# EAGLE design E (EAGLE 7.5.0)
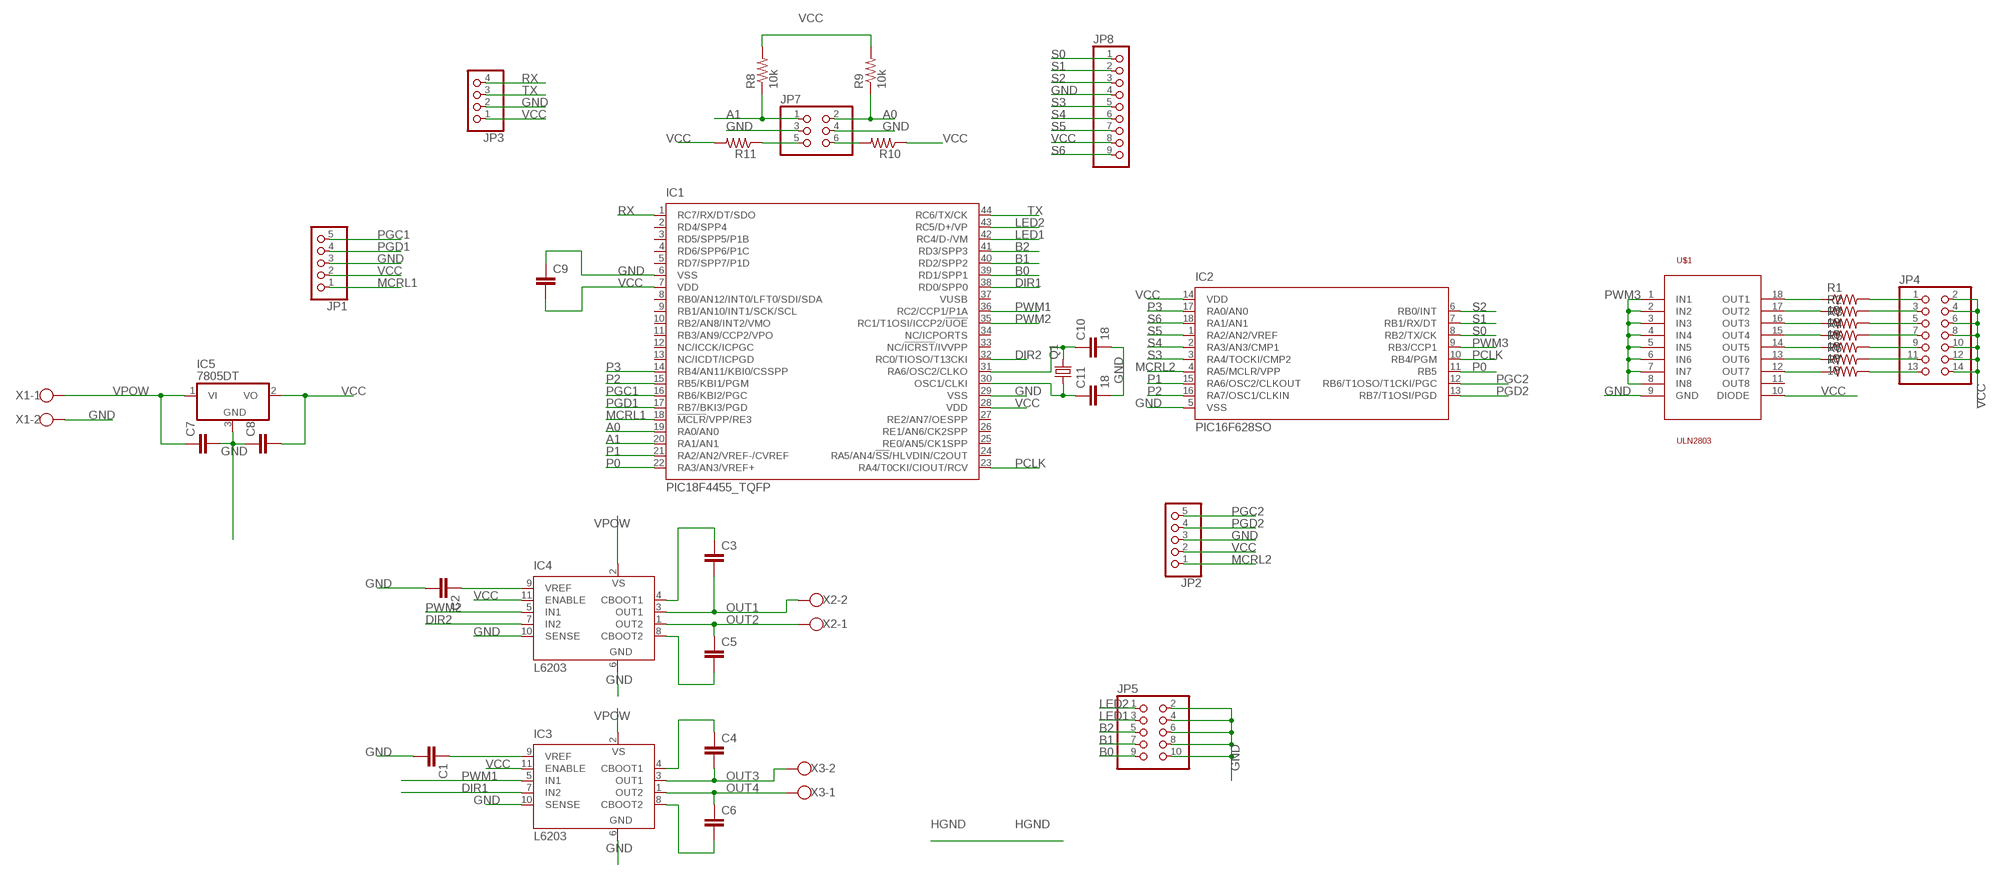
[diagram p0: schematic, sheet 1]

## Parts
C1  C2,5-3  [C2.5-3]
C2  C2,5-3  [C2.5-3]
C3  C2,5-3  [C2.5-3]
C4  C2,5-3  [C2.5-3]
C5  C2,5-3  [C2.5-3]
C6  C2,5-3  [C2.5-3]
C7  C2,5-3  [C2.5-3]
C8  C2,5-3  [C2.5-3]
C9  C2,5-3  [C2.5-3]
C10  18  C2,5-3  [C2.5-3]
C11  18  C2,5-3  [C2.5-3]
IC1  PIC18F4455_TQFP  [TQFP44]
IC2  PIC16F628SO  [SO-18W]
IC3  L6203  [MULTIWATT-11]
IC4  L6203  [MULTIWATT-11]
IC5  7805DT  [TO252]
JP1  PINHD-1X5  [1X05]
JP2  PINHD-1X5  [1X05]
JP3  PINHD-1X4  [1X04]
JP4  PINHD-2X7  [2X07]
JP5  PINHD-2X5  [2X05]
JP7  PINHD-2X3  [2X03]
JP8  PINHD-1X9  [1X09]
Q1  CRYSTALHC49S  [HC49/S]
R1  18  R-US_M1206  [M1206]
R2  18  R-US_M1206  [M1206]
R3  18  R-US_M1206  [M1206]
R4  18  R-US_M1206  [M1206]
R5  18  R-US_M1206  [M1206]
R6  18  R-US_M1206  [M1206]
R7  R-US_M1206  [M1206]
R8  10k  R-US_M1206  [M1206]
R9  10k  R-US_M1206  [M1206]
R10  R-US_M1206  [M1206]
R11  R-US_M1206  [M1206]
U$1  ULN2803  [SO18L]
X1  W237-102  [W237-102]
X2  W237-102  [W237-102]
X3  W237-102  [W237-102]

## Nets
A0: IC1.19(RA0/AN0) JP7.2 R9.1
A1: IC1.20(RA1/AN1) JP7.1 R8.1
B0: IC1.39(RD1/SPP1) JP5.9
B1: IC1.40(RD2/SPP2) JP5.7
B2: IC1.41(RD3/SPP3) JP5.5
DIR1: IC1.38(RD0/SPP0) IC3.7(IN2)
DIR2: IC1.32(RC0/TIOSO/T13CKI) IC4.7(IN2)
GND: C1.2 C2.2 C7.2 C8.1 C9.1 C10.2 C11.2 IC1.6(VSS) IC1.29(VSS) IC2.5(VSS) IC3.6(GND) IC3.10(SENSE) IC4.6(GND) IC4.10(SENSE) IC5.3(GND) JP1.3 JP2.3 JP3.2 JP5.2 JP5.4 JP5.6 JP5.8 JP5.10 JP7.3 JP7.4 JP8.4 U$1.9(GND) X1.2
LED1: IC1.42(RC4/D-/VM) JP5.3
LED2: IC1.43(RC5/D+/VP) JP5.1
MCRL1: IC1.18(!MCLR!/VPP/RE3) JP1.1
MCRL2: IC2.4(RA5/MCLR/VPP) JP2.1
N$1: C1.1 IC3.9(VREF)
N$2: C2.1 IC4.9(VREF)
N$3: C3.1 IC4.4(CBOOT1)
N$4: C4.1 IC3.4(CBOOT1)
N$5: C5.2 IC4.8(CBOOT2)
N$6: C6.2 IC3.8(CBOOT2)
N$7: R1.1 U$1.18(OUT1)
N$8: R2.1 U$1.17(OUT2)
N$9: R3.1 U$1.16(OUT3)
N$10: R4.1 U$1.15(OUT4)
N$11: R5.1 U$1.14(OUT5)
N$12: R6.1 U$1.13(OUT6)
N$13: R7.1 U$1.12(OUT7)
N$14: JP4.13 R7.2
N$15: JP4.11 R6.2
N$16: JP4.9 R5.2
N$17: JP4.7 R4.2
N$18: JP4.5 R3.2
N$19: JP4.3 R2.2
N$20: JP4.1 R1.2
N$21: JP7.5 R11.1
N$22: JP7.6 R10.2
N$23: C11.1 IC1.30(OSC1/CLKI) Q1.1
N$24: C10.1 IC1.31(RA6/OSC2/CLKO) Q1.2
OUT1 [VPOW]: C3.2 IC4.3(OUT1) X2.2
OUT2 [VPOW]: C5.1 IC4.1(OUT2) X2.1
OUT3 [VPOW]: C4.2 IC3.3(OUT1) X3.2
OUT4 [VPOW]: C6.1 IC3.1(OUT2) X3.1
P0: IC1.22(RA3/AN3/VREF+) IC2.11(RB5)
P1: IC1.21(RA2/AN2/VREF-/CVREF) IC2.15(RA6/OSC2/CLKOUT)
P2: IC1.15(RB5/KBI1/PGM) IC2.16(RA7/OSC1/CLKIN)
P3: IC1.14(RB4/AN11/KBI0/CSSPP) IC2.17(RA0/AN0)
PCLK: IC1.23(RA4/T0CKI/CIOUT/RCV) IC2.10(RB4/PGM)
PGC1: IC1.16(RB6/KBI2/PGC) JP1.5
PGC2: IC2.12(RB6/T1OSO/T1CKI/PGC) JP2.5
PGD1: IC1.17(RB7/BKI3/PGD) JP1.4
PGD2: IC2.13(RB7/T1OSI/PGD) JP2.4
PWM1: IC1.36(RC2/CCP1/P1A) IC3.5(IN1)
PWM2: IC1.35(RC1/T1OSI/ICCP2/!UOE) IC4.5(IN1)
PWM3: IC2.9(RB3/CCP1) U$1.1(IN1) U$1.2(IN2) U$1.3(IN3) U$1.4(IN4) U$1.5(IN5) U$1.6(IN6) U$1.7(IN7) U$1.8(IN8)
RX: IC1.1(RC7/RX/DT/SDO) JP3.4
S0: IC2.8(RB2/TX/CK) JP8.1
S1: IC2.7(RB1/RX/DT) JP8.2
S2: IC2.6(RB0/INT) JP8.3
S3: IC2.3(RA4/TOCKI/CMP2) JP8.5
S4: IC2.2(RA3/AN3/CMP1) JP8.6
S5: IC2.1(RA2/AN2/VREF) JP8.7
S6: IC2.18(RA1/AN1) JP8.9
TX: IC1.44(RC6/TX/CK) JP3.3
VCC: C8.2 C9.2 IC1.7(VDD) IC1.28(VDD) IC2.14(VDD) IC3.11(ENABLE) IC4.11(ENABLE) IC5.2(VO) JP1.2 JP2.2 JP3.1 JP4.2 JP4.4 JP4.6 JP4.8 JP4.10 JP4.12 JP4.14 JP8.8 R8.2 R9.2 R10.1 R11.2 U$1.10(DIODE)
VPOW [VPOW]: C7.1 IC3.2(VS) IC4.2(VS) IC5.1(VI) X1.1
Unconnected: IC1.2(RD4/SPP4) IC1.3(RD5/SPP5/P1B) IC1.4(RD6/SPP6/P1C) IC1.5(RD7/SPP7/P1D) IC1.8(RB0/AN12/INT0/LFT0/SDI/SDA) IC1.9(RB1/AN10/INT1/SCK/SCL) IC1.10(RB2/AN8/INT2/VMO) IC1.11(RB3/AN9/CCP2/VPO) IC1.12(NC/ICCK/ICPGC) IC1.13(NC/ICDT/ICPGD) IC1.24(RA5/AN4/!SS!/HLVDIN/C2OUT) IC1.25(RE0/AN5/CK1SPP) IC1.26(RE1/AN6/CK2SPP) IC1.27(RE2/AN7/OESPP) IC1.33(NC/!ICRST!/IVVPP) IC1.34(NC/ICPORTS) IC1.37(VUSB) U$1.11(OUT8)

## Library data of the parts
C1-C11 = capacitor-wima:C: CAPACITOR naming: grid - package width
IC1 = microchip:PIC18F4*_TQFP: USB Microcontrollers with nanoWatt Technology High-Performance, Enhanced Flash, 28/40/44-Pin, Source: http://ww1.microchip.com/downloads/en/devicedoc/39632c.pdf; MF: MICROCHIP; MPN: PIC18F4455-I/PT; OC_FARNELL: 9321322; OC_NEWARK: 08J9628
IC2 = microchip:PIC16F62*: FLASH-Based 8-Bit CMOS Microcontroller Source: http://ww1.microchip.com/downloads/en/DeviceDoc/40300C.pdf; MF: MICROCHIP; MPN: PIC16F628-20I/SO; OC_FARNELL: 9760415; OC_NEWARK: 23C4986
IC3 IC4 = st-microelectronics:L6203: DMOS FULL BRIDGE DRIVER; MPN: L6203; OC_FARNELL: 1467715; OC_NEWARK: 56P8434
IC5 = linear:78*: Positive VOLTAGE REGULATOR Source: http://cache.national.com/ds/LM/LM78L05.pdf http://www.fairchildsemi.com/ds/LM/LM7805.pdf
JP1 JP2 = pinhead:PINHD-1X5: PIN HEADER
JP3 = pinhead:PINHD-1X4: PIN HEADER
JP4 = pinhead:PINHD-2X7: PIN HEADER
JP5 = pinhead:PINHD-2X5: PIN HEADER
JP7 = pinhead:PINHD-2X3: PIN HEADER
JP8 = pinhead:PINHD-1X9: PIN HEADER
Q1 = crystal:CRYSTAL: CRYSTAL; OC_FARNELL: 1667008; OC_NEWARK: unknown
R1-R11 = resistor:R-US_: RESISTOR, American symbol
U$1 = uln2803:ULN2803
X1-X3 = con-wago-500:W237-102: WAGO SCREW CLAMP; MPN: 237-102; OC_FARNELL: unknown; OC_NEWARK: 70K9898

## Net classes
0 default: width 0.254 mm, clearance 0.254 mm
1 VPOW: width 1.016 mm, clearance 0.508 mm

## Board
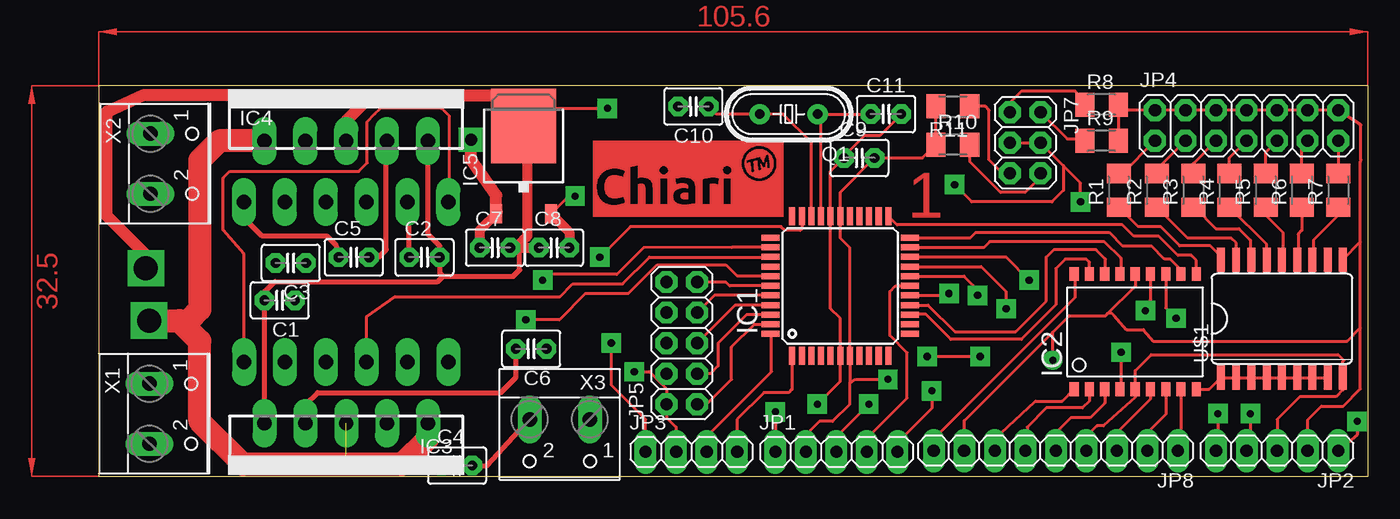
[diagram p1: board, top side]
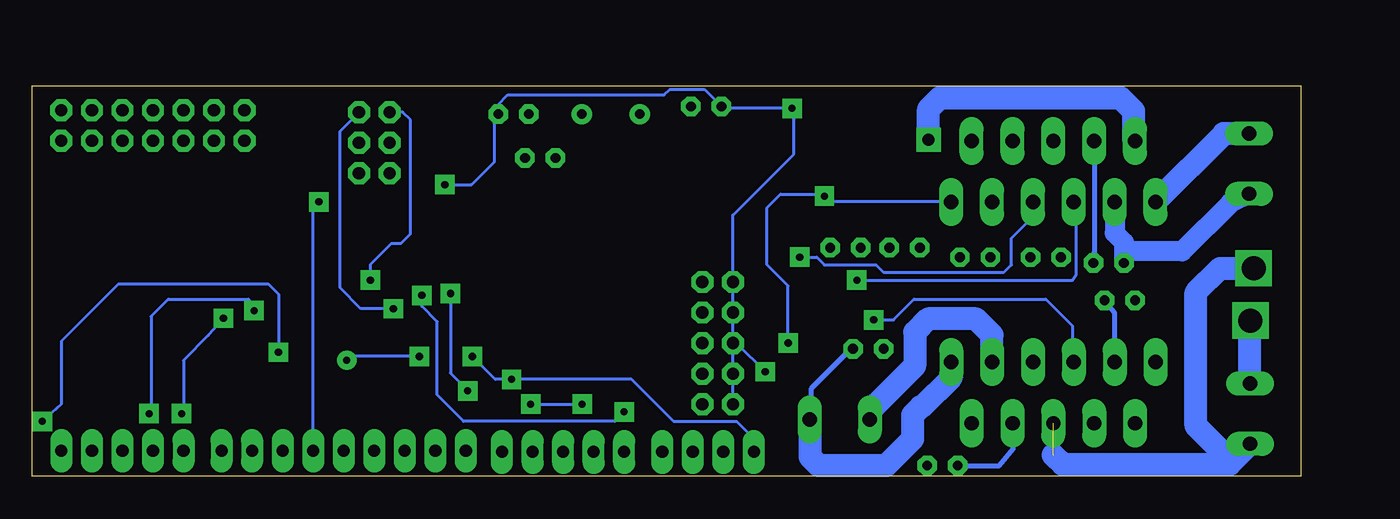
[diagram p2: board, bottom side, seen from below]

Size 105.6 x 32.5 mm. Coordinates in mm from the lower left corner, seen from the top.
Outline: 105.6,32.5 105.6,0 0,0 0,32.5 105.6,32.5
Copper layers (1*16): Top 0.035mm / dielectric 1.5mm / Bottom 0.035mm
Design rules "default *": minimum track width 10mil, minimum drill 24mil, track to track 8mil, track to pad 8mil, pad to pad 8mil, via to via 8mil, smd to smd 8mil, copper to edge 0mil, drill to drill 8mil, minimum pad ring 0.4mm, minimum via ring 20mil, stop-mask expansion 4mil, vias tented up to drill 0mil, thermal gap 10mil

### Footprints (pad centres in the part's own frame; a part is rotated, then mirrored left to right if it is on the bottom)
C2.5-3 = drill 0.813 pad 1.6 octagon: 1 -1.27,0; 2 1.27,0
TQFP44 = smd 1.5 x 0.5: 1 -5.8,4; 2 -5.8,3.2; 3 -5.8,2.4; 4 -5.8,1.6; 5 -5.8,0.8; 6 -5.8,0; 7 -5.8,-0.8; 8 -5.8,-1.6; 9 -5.8,-2.4; 10 -5.8,-3.2; 11 -5.8,-4; 23 5.8,-4; 24 5.8,-3.2; 25 5.8,-2.4; 26 5.8,-1.6; 27 5.8,-0.8; 28 5.8,0; 29 5.8,0.8; 30 5.8,1.6; 31 5.8,2.4; 32 5.8,3.2; 33 5.8,4 | smd 0.5 x 1.5: 12 -4,-5.8; 13 -3.2,-5.8; 14 -2.4,-5.8; 15 -1.6,-5.8; 16 -0.8,-5.8; 17 0,-5.8; 18 0.8,-5.8; 19 1.6,-5.8; 20 2.4,-5.8; 21 3.2,-5.8; 22 4,-5.8; 34 4,5.8; 35 3.2,5.8; 36 2.4,5.8; 37 1.6,5.8; 38 0.8,5.8; 39 0,5.8; 40 -0.8,5.8; 41 -1.6,5.8; 42 -2.4,5.8; 43 -3.2,5.8; 44 -4,5.8
SO-18W = smd 0.762 x 1.143: 1 -5.08,-4.788; 2 -3.81,-4.788; 3 -2.54,-4.788; 4 -1.27,-4.788; 5 0,-4.788; 6 1.27,-4.788; 7 2.54,-4.788; 8 3.81,-4.788; 9 5.08,-4.788; 10 5.08,4.788; 11 3.81,4.788; 12 2.54,4.788; 13 1.27,4.788; 14 0,4.788; 15 -1.27,4.788; 16 -2.54,4.788; 17 -3.81,4.788; 18 -5.08,4.788
MULTIWATT-11 = drill 1.2 long: 1 -8.5,-6.35; 2 -6.8,-1.27; 3 -5.1,-6.35; 4 -3.4,-1.27; 5 -1.7,-6.35; 6 0,-1.27; 7 1.7,-6.35; 8 3.4,-1.27; 9 5.1,-6.35; 10 6.8,-1.27; 11 8.5,-6.35
TO252 = smd 1 x 1.6: 1 -2.28,-4.8; 2 2.28,-4.8 | smd 5.4 x 6.2: 3 0,2.5
1X05 = drill 1.016 long: 1 -5.08,0; 2 -2.54,0; 3 0,0; 4 2.54,0; 5 5.08,0
1X04 = drill 1.016 long: 1 -3.81,0; 2 -1.27,0; 3 1.27,0; 4 3.81,0
2X07 = drill 1.016 octagon: 1 -7.62,-1.27; 2 -7.62,1.27; 3 -5.08,-1.27; 4 -5.08,1.27; 5 -2.54,-1.27; 6 -2.54,1.27; 7 0,-1.27; 8 0,1.27; 9 2.54,-1.27; 10 2.54,1.27; 11 5.08,-1.27; 12 5.08,1.27; 13 7.62,-1.27; 14 7.62,1.27
2X05 = drill 1.016 octagon: 1 -5.08,-1.27; 2 -5.08,1.27; 3 -2.54,-1.27; 4 -2.54,1.27; 5 0,-1.27; 6 0,1.27; 7 2.54,-1.27; 8 2.54,1.27; 9 5.08,-1.27; 10 5.08,1.27
2X03 = drill 1.016 octagon: 1 -2.54,-1.27; 2 -2.54,1.27; 3 0,-1.27; 4 0,1.27; 5 2.54,-1.27; 6 2.54,1.27
1X09 = drill 1.016 long: 1 -10.16,0; 2 -7.62,0; 3 -5.08,0; 4 -2.54,0; 5 0,0; 6 2.54,0; 7 5.08,0; 8 7.62,0; 9 10.16,0
HC49/S = drill 0.813 pad 1.676: 1 -2.413,0; 2 2.413,0
M1206 = smd 1.6 x 2: 1 -1.4,0; 2 1.4,0
SO18L = smd 0.66 x 2.032: 1 -5.08,-4.902; 2 -3.81,-4.902; 3 -2.54,-4.902; 4 -1.27,-4.902; 5 0,-4.902; 6 1.27,-4.902; 7 2.54,-4.902; 8 3.81,-4.902; 9 5.08,-4.902; 10 5.08,4.902; 11 3.81,4.902; 12 2.54,4.902; 13 1.27,4.902; 14 0,4.902; 15 -1.27,4.902; 16 -2.54,4.902; 17 -3.81,4.902; 18 -5.08,4.902
W237-102 = drill 1.194 long: 1 -2.5,-1.27; 2 2.5,-1.27

### Placement (x,y rotation side)
C1  15.05,14.65 180 top
C2  27.08,18.23 0 top
C3  15.97,17.76 180 top
C4  29.8,0.91 0 top
C5  21.21,18.23 0 top
C6  35.97,10.61 180 top
C7  32.96,19.03 0 top
C8  37.88,19.03 0 top
C9  63.28,26.49 0 top
C10  49.47,30.77 180 top
C11  65.5,30.14 0 top
IC1  61.69,15.85 90 top
IC2  86.23,12.04 0 top
IC3  20.57,3.15 180 top
IC4  20.57,29.19 0 top
IC5  35.34,26.65 0 top
JP1  61.37,2.04 0 top
JP2  98.04,2.14 180 top
JP3  49.31,2.04 0 top
JP4  95.5,29.19 0 top
JP5  48.51,11.09 90 top
JP7  77.09,27.76 270 top
JP8  79.63,2.14 180 top
Q1  57.4,30.14 180 top
R1  84.87,23.79 90 top
R2  88.04,23.79 90 top
R3  91.06,23.79 90 top
R4  94.08,23.79 90 top
R5  97.09,23.79 90 top
R6  100.11,23.79 90 top
R7  103.12,23.79 90 top
R8  83.44,30.93 0 top
R9  83.44,27.92 0 top
R10  71.06,27.6 0 top
R11  71.06,30.77 180 top
U$1  98.44,13.12 0 top
X1  5.48,5.22 270 top
X2  5.56,26.01 270 top
X3  38.35,3.47 180 top

### Tracks (layer width: path | path; a pad name or v marks a point on that pad's centre or on a via)
A0  (via drill 0.6)
  Top 0.254: JP7.2 80.58,28.08 81.88,28.08 R9.1 | IC1.19 73.42,17.45 75.5,15.38 v75.5,13.95
  Bottom 0.254: v75.5,13.95 78.2,13.95 79.95,15.69 79.95,28.71 JP7.2
A1  (via drill 0.6)
  Top 0.254: R8.1 82.04,31.22 81.22,32.05 76.77,32.05 75.82,31.09 JP7.1 | IC1.20 75.48,18.25 v77.41,16.33
  Bottom 0.254: v77.41,16.33 77.41,17.63 75.66,19.38 74.87,19.38 74.07,20.17 74.07,29.66 74.71,30.3 JP7.1
B0
  Top 0.254: IC1.39 52.48,15.85 52.17,16.17 JP5.9
B1
  Top 0.254: IC1.40 51.21,15.05 JP5.7
B2
  Top 0.254: JP5.5 52.96,14.26 55.88,14.26 IC1.41
DIR1  (via drill 0.6)
  Top 0.254: IC1.38 53.12,16.65 52.18,17.6 46.45,17.6 44.07,15.22 40.51,15.22 38.32,13.03 v35.53,13.03
  Bottom 0.254: v35.53,13.03 33.88,13.03 32.16,14.74 21.21,14.74 18.99,12.52 18.99,9.62 IC3.7
DIR2  (via drill 0.6)
  Top 0.254: IC1.32 58.49,20.59 58.36,20.46 57.09,20.46 56.77,20.77 44.23,20.77 v41.69,18.23
  Bottom 0.254: v41.69,18.23 40.26,18.23 39.62,17.6 35.34,17.6 34.7,16.96 24.7,16.96 24.07,17.6 24.07,19.82 22.32,21.57 22.32,22.79 IC4.7
GND  (via drill 0.6, 2)  (1 unrouted)
  Top 0.254: 35.66,28.71 37.56,30.62 v42.32,30.62 | JP1.3 61.37,3.31 v64.07,6.01 | v59.79,6.01 61.69,7.91 IC1.6 61.69,13.15 60.9,13.95 IC1.29 60.89,25.37 C9.1 62.01,26.65 63.75,28.39 65.02,28.39 C11.2 | JP2.3 98.04,4.74 99.95,6.64 102.97,6.64 103.52,7.2 U$1.9 103.52,9.58 103.6,9.66 103.12,10.14 87.57,10.14 86.23,8.8 IC2.5 86.23,6.58 83.6,4.2 83.06,4.2 82.17,3.31 JP8.4 | JP7.3 JP7.4 80.26,25.85 | 80.26,25.85 80.26,23.79 79.31,22.84 72.64,22.84 v71.22,24.27 | v81.69,22.84 81.69,24.42 80.26,25.85 | v44.55,8.71 45.82,8.71 47.24,7.28 47.24,4.9 48.04,4.11 JP3.2
  Top 0.406: IC4.10 27.4,27.89 27.4,20.14 28.35,19.19 C2.2 28.35,16.93 28.64,16.65 | 28.64,16.65 34.48,16.65 35.02,17.19 35.02,19.34 35.31,19.63 | IC3.10 C1.2 13.78,15.34 14.64,16.2 28.19,16.2 28.64,16.65
  Top 0.813: C8.1 C7.2 34.7,19.03 35.31,19.63 35.66,19.98 35.66,28.71 35.66,29.15 IC5.3
  Top 1.016: v3.91,17.31 3.91,18.42 0.66,21.67 0.66,30.34 3.75,31.73 21.7,31.73 | 21.7,31.73 22.16,31.73 | IC4.6 20.57,29.57 22.7,31.7 | 22.7,31.7 32.79,31.7 IC5.3 | 22.7,31.7 21.73,31.7 21.7,31.73
  Bottom 0.254: v64.07,6.01 v59.79,6.01 | v71.22,24.27 68.99,24.27 67.09,26.17 67.09,29.82 C11.2 66.77,30.93 65.98,31.73 52.96,31.73 52.48,32.2 49.62,32.2 C10.2 48.04,30.62 v42.32,30.62 42.16,30.46 42.16,26.81 47.24,21.73 JP5.10 JP5.8 JP5.6 | JP5.2 JP5.4 JP5.6 | JP5.6 46.93,11.09 v44.55,8.71 | JP8.4 82.17,22.36 v81.69,22.84
  Bottom 1.93: 20.57,1.77 19.8,1 5.93,1 | 5.93,1 X1.2 | 5.93,1 5.93,1.43 8.7,4.2 8.7,15.3 6.7,17.3 3.92,17.3 v3.91,17.31
LED1
  Top 0.254: IC1.42 53.89,13.45 51.53,11.09 51.53,9.19 50.9,8.55 JP5.3
LED2
  Top 0.254: JP5.1 50.58,6.01 52.64,8.07 52.64,10.77 54.55,12.68 55.87,12.68 IC1.43
MCRL1  (via drill 0.6)
  Top 0.254: IC1.18 72,16.65 73.12,15.53 v73.12,15.06 | v56.29,5.38 JP1.1
  Bottom 0.254: v56.29,5.38 57.09,4.58 69.66,4.58 71.85,6.77 71.85,12.87 73.12,14.14 v73.12,15.06
MCRL2  (via drill 0.6)
  Top 0.254: 84.87,7.35 IC2.4 85.06,7.35 v85.06,10.33 | v104.71,4.58 104.71,3.47 JP2.1
  Bottom 0.254: v104.71,4.58 103.12,6.01 103.12,11.25 98.36,16.01 85.92,16.01 85.06,15.15 v85.06,10.33
N$1
  Bottom 0.406: IC3.9 15.47,13.61 C1.1
N$2
  Top 0.406: C2.1 25.81,22.7 IC4.9
N$3
  Bottom 0.406: IC4.4 17.17,18.62 C3.1
N$4
  Bottom 0.406: C4.1 25.08,0.91 23.91,2.28 23.91,4.36 IC3.4
N$5
  Top 0.406: C5.2 23.27,18.23 23.91,18.87 23.91,27.85 IC4.8
N$6
  Top 0.406: IC3.8 17.17,5.94 18.19,6.96 33.43,6.96 34.7,8.23 C6.2
N$7
  Top 0.254: U$1.18 93.36,18.31 92.49,19.19 89.95,19.19 88.36,20.77 86.48,20.77 R1.1
N$8
  Top 0.254: U$1.17 94.63,19.42 94.23,19.82 90.61,19.82 R2.1
N$9
  Top 0.254: R3.1 91.19,22.39 92.96,20.62 94.87,20.62 95.82,19.66 95.82,18.1 U$1.16
N$10
  Top 0.254: U$1.15 97.17,19.29 R4.1
N$11
  Top 0.254: R5.1 97.09,21.73 98.52,20.3 98.52,18.1 U$1.14
N$12
  Top 0.254: R6.1 100.11,20.46 99.79,20.14 99.79,18.1 U$1.13
N$13
  Top 0.254: R7.1 103.12,21.73 101.06,19.66 101.06,18.1 U$1.12
N$14
  Top 0.254: JP4.13 R7.2
N$15
  Top 0.254: R6.2 100.11,27.44 JP4.11
N$16
  Top 0.254: R5.2 97.09,26.96 JP4.9
N$17
  Top 0.254: R4.2 94.08,26.49 JP4.7
N$18
  Top 0.254: R3.2 91.06,26.01 JP4.5
N$19
  Top 0.254: R2.2 88.04,25.54 JP4.3
N$20
  Top 0.254: R1.2 85.16,25.19 JP4.1
N$21
  Top 0.254: JP7.5 75.18,25.22 74.07,26.33 74.07,30.46 73.76,30.77 R11.1
N$22
  Top 0.254: JP7.6 78.36,24.9 77.09,23.63 75.03,23.63 72.48,26.17 72.48,27.57 R10.2
N$23
  Top 0.254: IC1.30 60.09,29.87 Q1.1 C11.1
N$24
  Top 0.254: IC1.31 59.29,27.78 56.93,30.14 Q1.2 51.37,30.14 C10.1
OUT1
  Bottom 1.676: IC4.3 15.47,20.25 14.7,19.47 14.7,18.71 | 14.7,18.71 C3.2 | X2.2 5.81,22.77 9.87,18.71 14.7,18.71
OUT2
  Top 0.406: C5.1 19.78,19.19 18.99,19.98 13.59,19.98 12,21.57 12,22.77 IC4.1
  Bottom 1.93: X2.1 6.4,28.51 IC4.1
OUT3
  Top 0.406: C4.2 32.32,0.91 X3.2
  Bottom 1.93: IC3.3 25.67,11.77 27,13.1 31,13.1 32.1,12 32.1,9.2 35.8,5.5 35.8,4.79 X3.2
OUT4
  Bottom 0.406: C6.1 37.4,10.61 40.73,7.28 40.73,4.86 X3.1
  Bottom 1.93: IC3.1 29.07,8.23 31.5,5.8 31.6,5.8 32.3,5.1 32.3,3.1 34.5,0.9 40.1,0.9 40.8,1.6 40.8,4.69 X3.1
P0
  Top 0.254: IC2.11 90.04,17.19 89.15,18.08 88.68,18.08 87.57,19.19 85.19,19.19 84.07,20.3 72.96,20.3 72.52,19.85 IC1.22
P1
  Top 0.254: IC2.15 85.03,16.89 85.03,18.17 83.66,19.54 74.14,19.54 73.63,19.03 67.52,19.03 IC1.21
P2
  Top 0.254: IC1.15 69.01,14.25 71.22,12.04 76.3,12.04 78.84,14.58 78.84,18.23 79.47,18.87 82.96,18.87 83.76,18.08 83.76,16.89 IC2.16
P3
  Top 0.254: IC1.14 67.51,13.47 68.83,13.47 70.9,11.41 76.77,11.41 79.63,14.26 79.63,17.28 80.42,18.08 82.17,18.08 82.42,17.82 IC2.17
PCLK
  Top 0.254: IC2.10 91.31,17.98 90.9,18.39 89.79,18.39 88.2,19.98 86.14,19.98 85.19,20.93 66.41,20.93 IC1.23
PGC1  (via drill 0.6)
  Top 0.254: IC1.16 70.1,15.06 v70.74,15.22 | v69.31,7.12 69.31,5.66 66.45,2.8 JP1.5
  Bottom 0.254: v70.74,15.22 70.74,8.58 v69.31,7.12
PGC2  (via drill 0.6)
  Top 0.254: IC2.12 88.77,14.01 v89.63,13.15 | v93.12,5.22 93.12,2.04 JP2.5
  Bottom 0.254: v89.63,13.15 90.9,11.72 92.96,9.66 92.96,5.38 v93.12,5.22
PGD1
  Top 0.254: IC1.17 66.29,15.85 65.82,15.38 65.82,11.72 67.25,10.3 67.25,6.52 63.91,3.18 JP1.4
PGD2  (via drill 0.6)
  Top 0.254: IC2.13 87.5,14.68 v87.09,13.79 | v95.82,5.22 95.82,2.2 JP2.4
  Bottom 0.254: v87.09,13.79 87.57,14.74 94.23,14.74 95.66,13.31 95.66,5.38 v95.82,5.22
PWM1
  Top 0.254: IC3.5 22.27,13.27 24.64,14.96 38.39,14.96 39.43,16.01 43.59,16.01 45.82,18.23 55.87,18.23 IC1.36
PWM2  (via drill 0.6)
  Top 0.254: IC1.35 52.67,19.05 45.34,19.03 43.12,16.8 37.4,16.8 v36.93,16.33
  Bottom 0.254: v36.93,16.33 18.99,16.33 18.67,16.8 18.67,22.47 IC4.5
PWM3
  Top 0.254: IC2.9 92.39,7.25 U$1.1 U$1.2 U$1.3 U$1.4 U$1.5 U$1.6 U$1.7 U$1.8
RX
  Top 0.254: IC1.1 57.69,7.25 57.4,6.96 55.34,6.96 53.12,4.74 JP3.4
S0
  Top 0.254: IC2.8 90.04,1.82 JP8.1
S1
  Top 0.254: IC2.7 88.77,5.15 87.25,3.63 JP8.2
S2
  Top 0.254: IC2.6 87.5,6.42 84.71,3.63 JP8.3
S3
  Top 0.254: IC2.3 83.69,6.11 82.49,4.9 80.9,4.9 79.63,3.63 JP8.5
S4
  Top 0.254: IC2.2 82.42,6.26 81.85,5.69 78.84,5.69 77.25,4.11 77.25,1.72 JP8.6
S5
  Top 0.254: JP8.7 74.55,3.12 77.95,6.26 80.16,6.26 IC2.1
S6
  Top 0.254: IC2.18 81.25,16.73 81.25,14.9 69.47,3.12 JP8.9
TX
  Top 0.254: JP3.3 50.58,3.31 55.98,8.71 55.98,11.77 IC1.44
VCC  (via drill 0.6)
  Top 0.254: 104.98,12.36 104.98,7.28 103.55,5.85 101.73,5.85 100.58,4.71 JP2.2 | 104.98,12.36 104.98,19.5 | 104.98,19.5 104.98,26.16 105.01,26.35 105.01,29.25 JP4.14 JP4.12 JP4.10 JP4.8 JP4.6 JP4.4 JP4.2 85.31,30.46 R8.2 R9.2 | 104.98,12.36 103.87,11.25 87.73,11.25 86.93,12.2 85.5,12.2 84.45,13.41 84.3,13.57 83.98,13.57 | v39.62,23.31 39.08,23.31 IC5.2 | IC3.11 12.07,18.48 10.35,20.46 10.35,24.84 10.89,25.38 21.62,25.38 22.32,26.08 22.32,29.52 22.95,30.15 23.4,30.6 23.42,30.62 28.51,30.62 29.15,29.98 29.15,22.91 IC4.11 | 62.49,7.76 IC1.7 62.49,19.02 61.69,19.82 IC1.28 61.69,23.63 C9.2 68.55,26.49 R10.1 69.66,30.65 70.26,31.25 70.13,31.25 R11.2 | JP1.2 58.83,3.47 59.94,4.58 61.05,4.58 62.49,6.02 62.49,7.76 | v42.64,11.09 42.64,7.6 45.5,4.74 JP3.1 45.5,3.63 | 62.49,7.76 62.96,8.07 v65.66,8.07 | v68.93,9.98 v73.34,9.98 | U$1.10 103.52,18.04 104.98,19.5 | JP8.8 72.01,4.64 79.38,12.01 | v79.38,9.66 79.38,12.01 | 79.38,12.01 80.74,13.38 83.79,13.38 83.98,13.57 | 83.98,13.57 86.23,15.82 IC2.14
  Top 0.813: IC5.2 37.78,21.67 39.15,20.3 C8.2
  Bottom 0.254: IC4.11 39.15,22.84 v39.62,23.31 39.78,23.47 43.28,23.47 44.39,22.36 44.39,17.6 42.64,15.85 v42.64,11.09 | v68.93,9.98 67.02,8.07 v65.66,8.07 55.66,8.07 52.17,4.58 46.93,4.58 45.5,3.15 JP3.1 | v73.34,9.98 79.06,9.98 v79.38,9.66
VPOW  (via drill 1, 2)
  Top 0.813: IC5.1 33.22,21.99 31.69,20.46 C7.1
  Top 1.016: IC5.1 33.06,23.37 30.96,26.33 v30.96,28.01
  Top 1.93: IC4.2 10.02,27.92 8.4,26.3 8.4,13.9 7.46,12.96 6.7,12.96 | v4.17,12.96 6.7,12.96 | IC3.2 27.37,3.17 25.2,1 12,1 8.4,4.6 8.4,11.26 6.7,12.96
  Bottom 1.016: 14.22,28.37 IC4.2
  Bottom 1.93: v30.96,28.01 30.96,30.54 30,31.5 15,31.5 13.9,30.4 13.9,28.04 IC4.2 | X1.1 4.21,12.93 v4.17,12.96
(copper drawn outside any net)
  shapes: Top area x1132

### Text on the board
Top: 1